# Altium project USB_Serial.PrjPcb
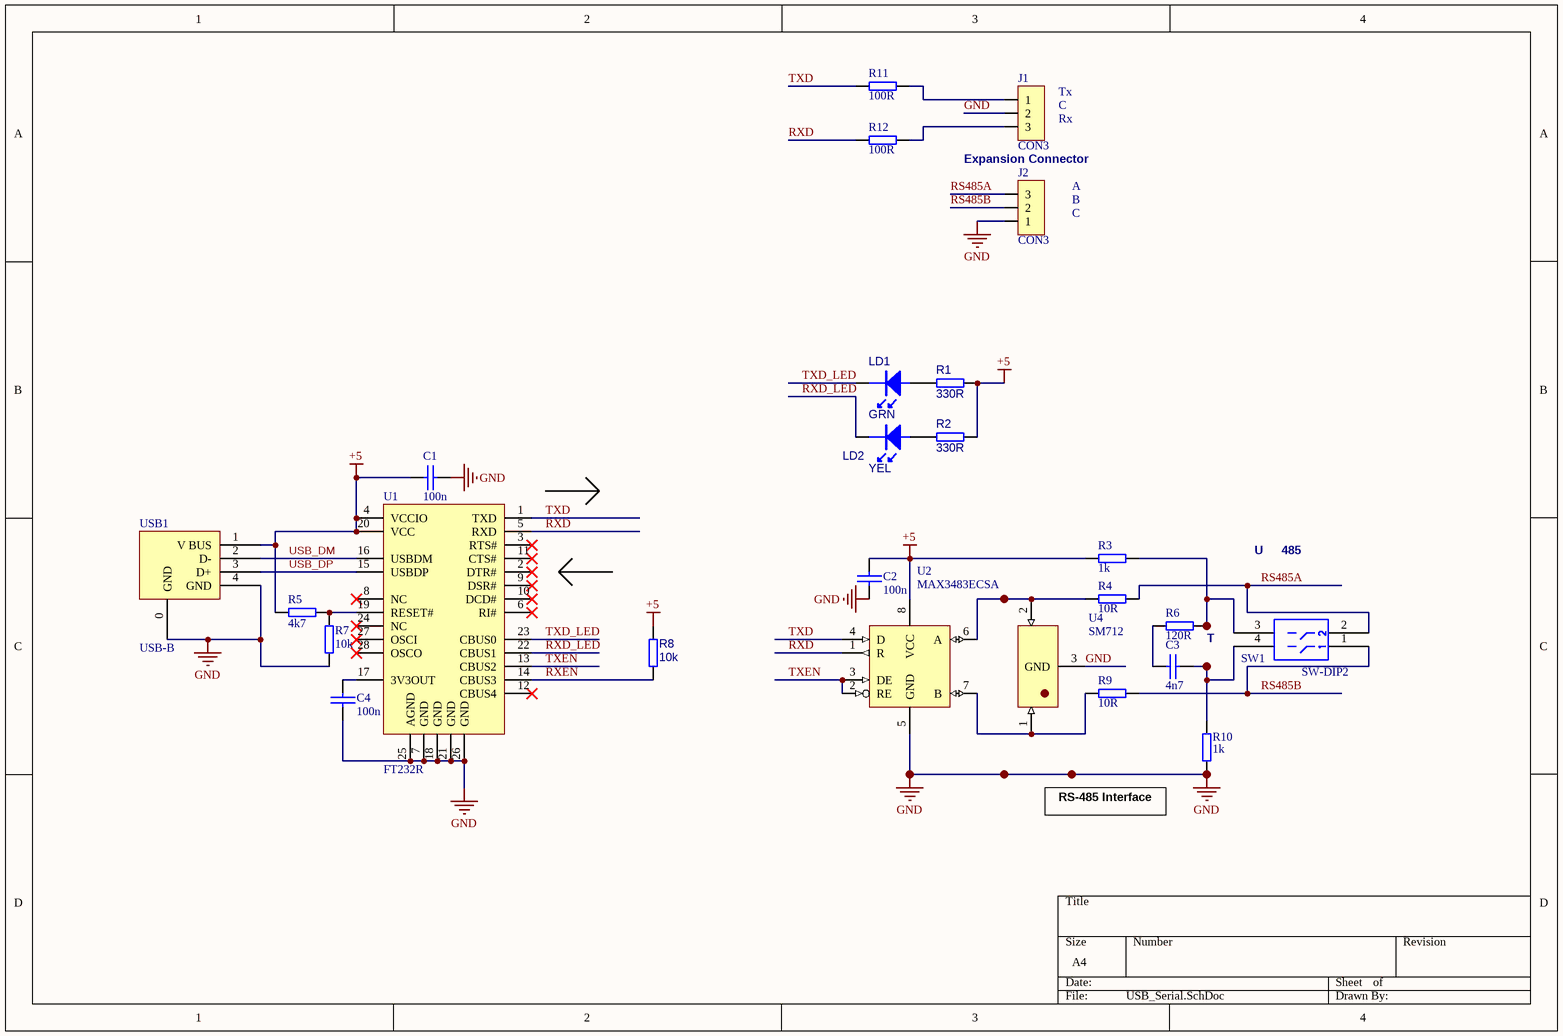
[diagram p0: USB_Serial.SchDoc]
1 sheet, 25 parts. Net scope: global (net labels, ports and power ports of the same name join across sheets).
Board file: USB_Serial.PcbDoc

## Sheet USB_Serial.SchDoc
size A4

### Parts
C1  100n  [0603]
C2  100n  [0603]
C3  4n7  [0603]
C4  100n  [0603]
J1  CON3  [TERMS5mm3]
J2  CON3  [TERMS5mm3]
LD1  GRN  [0805DIODE]
LD2  YEL  [0805DIODE]
R1  330R  [0603]
R2  330R  [0603]
R3  1k  [0603]
R4  10R  [0603]
R5  4k7  [0603]
R6  120R  [0603]
R7  10k  [0603]
R8  10k  [0603]
R9  10R  [0603]
R10  1k  [0603]
R11  100R  [0603]
R12  100R  [0603]
SW1  SW-DIP2  [DIP4]
U1  FT232R  [SSOP28W-handsolder]
U2  MAX3483ECSA  [so-8]
U4  SM712  [sot-23]
USB1  USB-B  [USB_MINI_B]

### Nets
+5: C1.2 C2.1 R1.1 R2.1 R3.1 R5.1 R8.1 U1.4(VCCIO) U1.20(VCC) U2.8(VCC) USB1.1(V_BUS)
GND: C1.1 C2.2 C4.1 J1.2 J2.1 R7.1 R10.2 U1.7(GND) U1.18(GND) U1.21(GND) U1.25(AGND) U1.26(GND) U2.5(GND) U4.3(GND) USB1.0(GND) USB1.4(GND)
RS485A: J2.3 R4.2 SW1.2
RS485B: J2.2 R9.2 SW1.1
RXD: R12.1 U1.5(RXD) U2.1(R)
RXD_LED: LD2.K U1.22(CBUS1)
RXEN: R8.2 U1.14(CBUS3)
TXD: R11.1 U1.1(TXD) U2.4(D)
TXD_LED: LD1.K U1.23(CBUS0)
TXEN: U1.13(CBUS2) U2.2(RE) U2.3(DE)
USB_DM: U1.16(USBDM) USB1.2(D-)
USB_DP: U1.15(USBDP) USB1.3(D+)
NetC3_1: C3.1 R6.1
NetC3_2: C3.2 R10.1 SW1.4
NetC4_2: C4.2 U1.17(3V3OUT)
NetJ1_1: J1.1 R11.2
NetJ1_3: J1.3 R12.2
NetLD1_A: LD1.A R1.2
NetLD2_A: LD2.A R2.2
NetR3_2: R3.2 R6.2 SW1.3
NetR4_1: R4.1 U2.6(A) U4.2
NetR5_2: R5.2 R7.2 U1.19(RESET#)
NetR9_1: R9.1 U2.7(B) U4.1

Not connected (* = marked no-connect by the designer): U1 2(DTR#)* 3(RTS#)* 6(RI#)* 8(NC)* 9(DSR#)* 10(DCD#)* 11(CTS#)* 12(CBUS4)* 24(NC)* 27(OSCI)* 28(OSCO)*

### Notes on the sheet
- (near J1) C
- (near J1) Tx
- Expansion Connector
- (near J1) Rx
- A
- B
- C
- U
- 485
- (near R6) T
- (near R10) RS-485 Interface

### Library data of the parts
C1-C4 = CAP
LD1 LD2 = LED
R1-R12 = RES8
U2 = MAX487: RS485 Transceiver
U4 = SM712: RS485 Transorb; PartNo.: 2059024; Supplier: Digi-Key